# Altium schematic sheet Mix_8ch.SchDoc
size A4
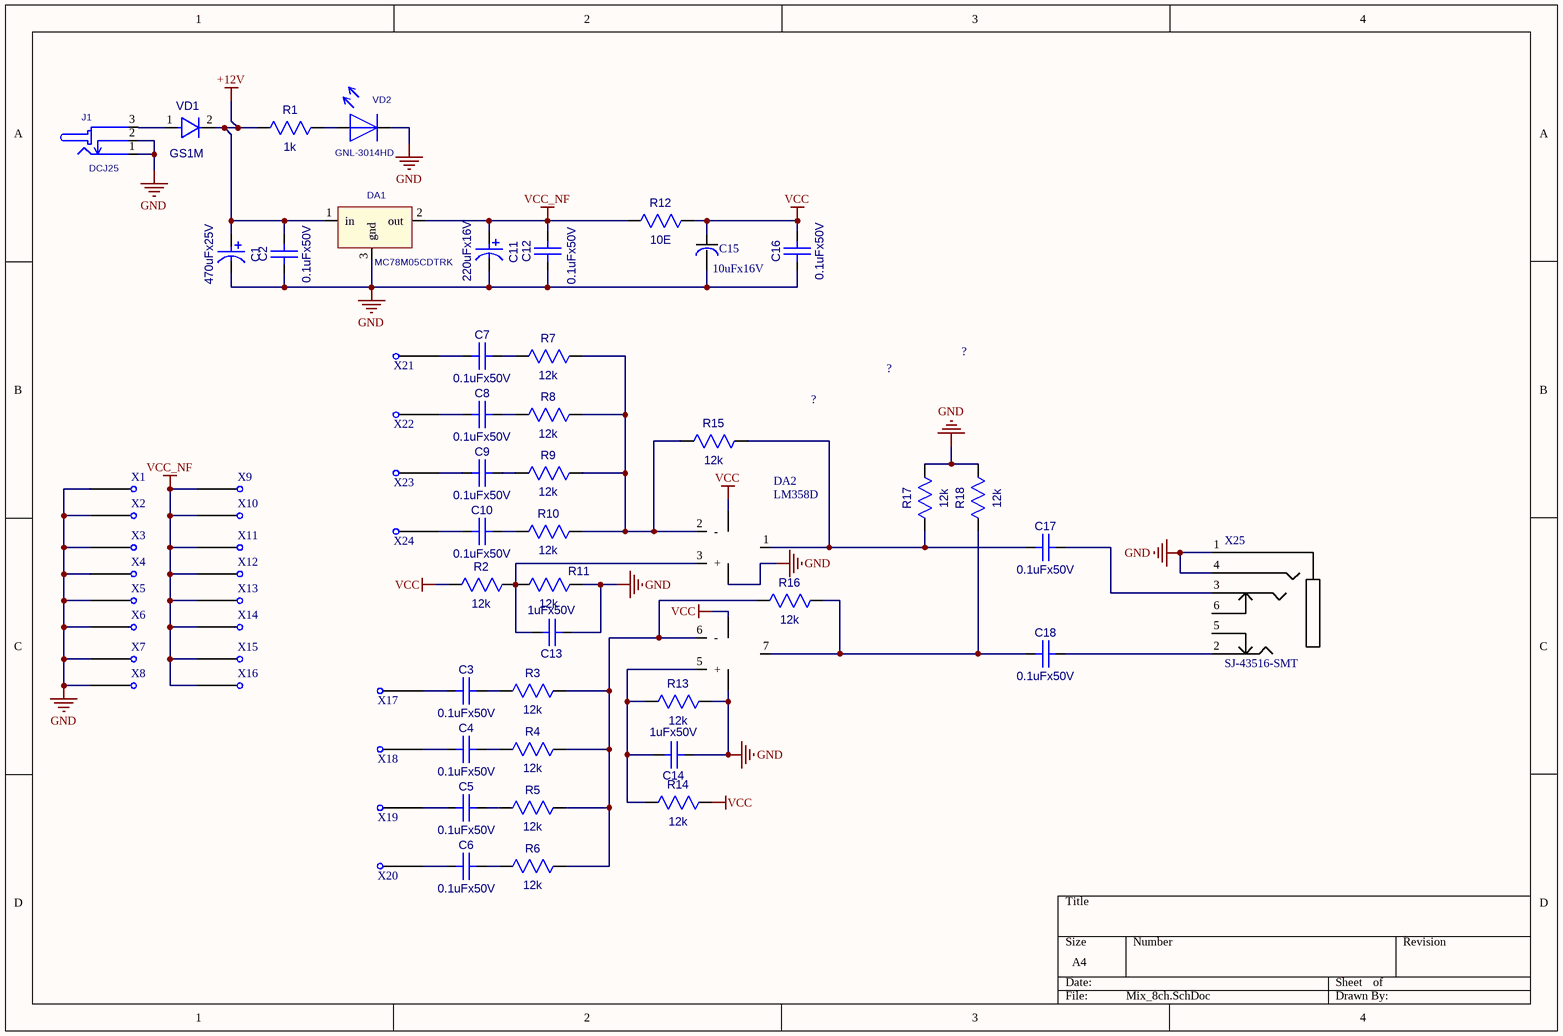
[diagram p0: Mix_8ch.SchDoc]

## Parts
(Parts that share a designator on the sheet are numbered #1, #2 ... from top to bottom, then left to right.)
?#1  REPER1.2  [REPER1.2]  (value not drawn)
?#2  REPER1.2  [REPER1.2]  (value not drawn)
?#3  REPER1.2  [REPER1.2]  (value not drawn)
C1  470uFx25V  [CC16X10_CAP0.5(1)(Primary)]
C2  0.1uFx50V  [CC0603-3M]
C3  0.1uFx50V  [CC0603-3M]
C4  0.1uFx50V  [CC0603-3M]
C5  0.1uFx50V  [CC0603-3M]
C6  0.1uFx50V  [CC0603-3M]
C7  0.1uFx50V  [CC0603-3M]
C8  0.1uFx50V  [CC0603-3M]
C9  0.1uFx50V  [CC0603-3M]
C10  0.1uFx50V  [CC0603-3M]
C11  220uFx16V  [CC8X3.5]
C12  0.1uFx50V  [CC0603-3M]
C13  1uFx50V  [CC0603-3M]
C14  1uFx50V  [CC0603-3M]
C15  10uFx16V  [Cap_5x8]
C16  0.1uFx50V  [CC0603-3M]
C17  0.1uFx50V  [CC0603-3M]
C18  0.1uFx50V  [CC0603-3M]
DA1  MC78M05CDTRK  [D-PAK(TO-252AA)]
DA2  LM358D  [SO-8]
J1  DCJ25  [DCJ25]
R1  1k  [RC0603-3M]
R2  12k  [RC0603-3M]
R3  12k  [RC0603-3M]
R4  12k  [RC0603-3M]
R5  12k  [RC0603-3M]
R6  12k  [RC0603-3M]
R7  12k  [RC0603-3M]
R8  12k  [RC0603-3M]
R9  12k  [RC0603-3M]
R10  12k  [RC0603-3M]
R11  12k  [RC0603-3M]
R12  10E  [RC0805_IPC_NOM]
R13  12k  [RC0603-3M]
R14  12k  [RC0603-3M]
R15  12k  [RC0603-3M]
R16  12k  [RC0603-3M]
R17  12k  [RC0603-3M]
R18  12k  [RC0603-3M]
VD1  GS1M  [SMA]
VD2  GNL-3014HD  [LED3]
X1  PIN_1mm  [PIN_1mm]  (value not drawn)
X2  PIN_1mm  [PIN_1mm]  (value not drawn)
X3  PIN_1mm  [PIN_1mm]  (value not drawn)
X4  PIN_1mm  [PIN_1mm]  (value not drawn)
X5  PIN_1mm  [PIN_1mm]  (value not drawn)
X6  PIN_1mm  [PIN_1mm]  (value not drawn)
X7  PIN_1mm  [PIN_1mm]  (value not drawn)
X8  PIN_1mm  [PIN_1mm]  (value not drawn)
X9  PIN_1mm  [PIN_1mm]  (value not drawn)
X10  PIN_1mm  [PIN_1mm]  (value not drawn)
X11  PIN_1mm  [PIN_1mm]  (value not drawn)
X12  PIN_1mm  [PIN_1mm]  (value not drawn)
X13  PIN_1mm  [PIN_1mm]  (value not drawn)
X14  PIN_1mm  [PIN_1mm]  (value not drawn)
X15  PIN_1mm  [PIN_1mm]  (value not drawn)
X16  PIN_1mm  [PIN_1mm]  (value not drawn)
X17  PIN_1mm  [PIN_1mm]  (value not drawn)
X18  PIN_1mm  [PIN_1mm]  (value not drawn)
X19  PIN_1mm  [PIN_1mm]  (value not drawn)
X20  PIN_1mm  [PIN_1mm]  (value not drawn)
X21  PIN_1mm  [PIN_1mm]  (value not drawn)
X22  PIN_1mm  [PIN_1mm]  (value not drawn)
X23  PIN_1mm  [PIN_1mm]  (value not drawn)
X24  PIN_1mm  [PIN_1mm]  (value not drawn)
X25  SJ-43516-SMT  [SJ-43516-SMT]

## Nets
+12V: C1.2 C2.2(B) DA1.1(in) R1.1(A) VD1.2(K)
GND: C1.1 C2.1(A) C11.2 C12.1(A) C13.1(A) C14.1(A) C15.- C16.1(A) DA1.3(gnd) DA2.4(Vss) J1.1 J1.2 R11.2(B) R13.2(B) R17.2(B) R18.2(B) VD2.1 X1.1 X2.1 X3.1 X4.1 X5.1 X6.1 X7.1 X8.1 X25.1 X25.4
VCC: C15.+ C16.2(B) DA2.8(Vdd) R2.1(A) R12.2(B) R14.2(B)
VCC_NF: C11.1 C12.2(B) DA1.2(out) R12.1(A) X9.1 X10.1 X11.1 X12.1 X13.1 X14.1 X15.1 X16.1
NetC3_1: C3.1(A) X17.1
NetC3_2: C3.2(B) R3.1(A)
NetC4_1: C4.1(A) X18.1
NetC4_2: C4.2(B) R4.1(A)
NetC5_1: C5.1(A) X19.1
NetC5_2: C5.2(B) R5.1(A)
NetC6_1: C6.1(A) X20.1
NetC6_2: C6.2(B) R6.1(A)
NetC7_1: C7.1(A) X21.1
NetC7_2: C7.2(B) R7.1(A)
NetC8_1: C8.1(A) X22.1
NetC8_2: C8.2(B) R8.1(A)
NetC9_1: C9.1(A) X23.1
NetC9_2: C9.2(B) R9.1(A)
NetC10_1: C10.1(A) X24.1
NetC10_2: C10.2(B) R10.1(A)
NetC13_2: C13.2(B) DA2.3(+) R2.2(B) R11.1(A)
NetC14_2: C14.2(B) DA2.5(+) R13.1(A) R14.1(A)
NetC17_1: C17.1(A) DA2.1(Out1) R15.2(B) R17.1(A)
NetC17_2: C17.2(B) X25.3
NetC18_1: C18.1(A) DA2.7(Out2) R16.2(B) R18.1(A)
NetC18_2: C18.2(B) X25.2
NetDA2_2: DA2.2(-) R7.2(B) R8.2(B) R9.2(B) R10.2(B) R15.1(A)
NetDA2_6: DA2.6(-) R3.2(B) R4.2(B) R5.2(B) R6.2(B) R16.1(A)
NetJ1_3: J1.3 VD1.1(A)
NetR1_2: R1.2(B) VD2.2

Not connected (* = marked no-connect by the designer): ?#1 1; ?#2 1; ?#3 1; X25 5 6

## Library data of the parts
C1 = CAP0.5(1): Jamicon TKR; Value: 470uFx25V
C2-C10 C12-C14 C16-C18 = CC0603: CC0603 X7R
  C2-C10 C12 C16-C18: Value: 0.1uFx50V
  C13 C14: Value: 1uFx50V
C11 = CAP0.35: Value: 220uFx16V
C15 = Cap_5x8: Jamicon TKR; Value: 10uFx16V
R1-R11 R13-R18 = RC0603
  R1: Value: 1k
  R2-R11 R13-R18: Value: 12k
R12 = RC0805: Value: 10E
VD1 = GS1M: Value: {Value}
VD2 = LED_3: Value: GNL-3014HD
X25 = SJ-43516-SMT: 3.5mm connector 4 conductors
?#1-?#3 = REPER1.2: Value: *
DA1 = MC78M05CDTRK: Value: *
DA2 = LM358D: Value: LM358D
J1 = DCJ25: Value: *